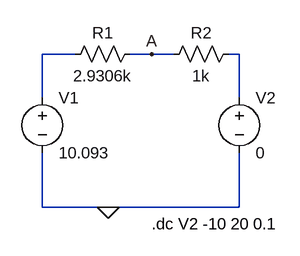
[diagram p0: schematic online lab02 task04.asc]
online lab02 task04.asc, the LTspice schematic file:
Version 4
SHEET 1 880 680
WIRE 112 80 64 80
WIRE 224 80 192 80
WIRE 256 80 224 80
WIRE 352 80 336 80
WIRE 64 144 64 80
WIRE 352 144 352 80
WIRE 64 304 64 224
WIRE 160 304 64 304
WIRE 352 304 352 224
WIRE 352 304 160 304
FLAG 160 304 0
FLAG 224 80 A
SYMBOL voltage 64 128 R0
SYMATTR InstName V1
SYMATTR Value 10.093
SYMBOL voltage 352 128 R0
SYMATTR InstName V2
SYMATTR Value 0
SYMBOL res 208 64 R90
WINDOW 0 0 56 VBottom 2
WINDOW 3 32 56 VTop 2
SYMATTR InstName R1
SYMATTR Value 2.9306k
SYMBOL res 352 64 R90
WINDOW 0 0 56 VBottom 2
WINDOW 3 32 56 VTop 2
SYMATTR InstName R2
SYMATTR Value 1k
TEXT 224 328 Left 2 !.dc V2 -10 20 0.1

The netlist it stands for:
* online lab02 task04.asc
V1 N001 0 10.093
V2 N002 0 0
R1 A N001 2.9306k
R2 N002 A 1k
.dc V2 -10 20 0.1
.backanno
.end